# Altium schematic sheet VCO_OUT_channel.SchDoc: Output stage :
size 420 x 297 mm; Author: K.B.; CompanyName: WUT; DrawnBy: K.B.; Organization: WUT ISE; Address1: Warsaw Univeristy of Technology; Address2: Nowowiejska 15/19; DocumentNumber: 5; Revision: -; SheetNumber: 5; SheetTotal: 8; EDA_Number: ARTIQ; Projet: ARTIQ/SINARA; ModifiedBy: -; CreateDate: XX/XX/XXXX; CheckedDate: -; Title2: Attenuator, amplifier and filter; DivGrp: ISE; Designer: K.B.; ModifiedDate: -; ProjectName: ARTIQ/SINARA
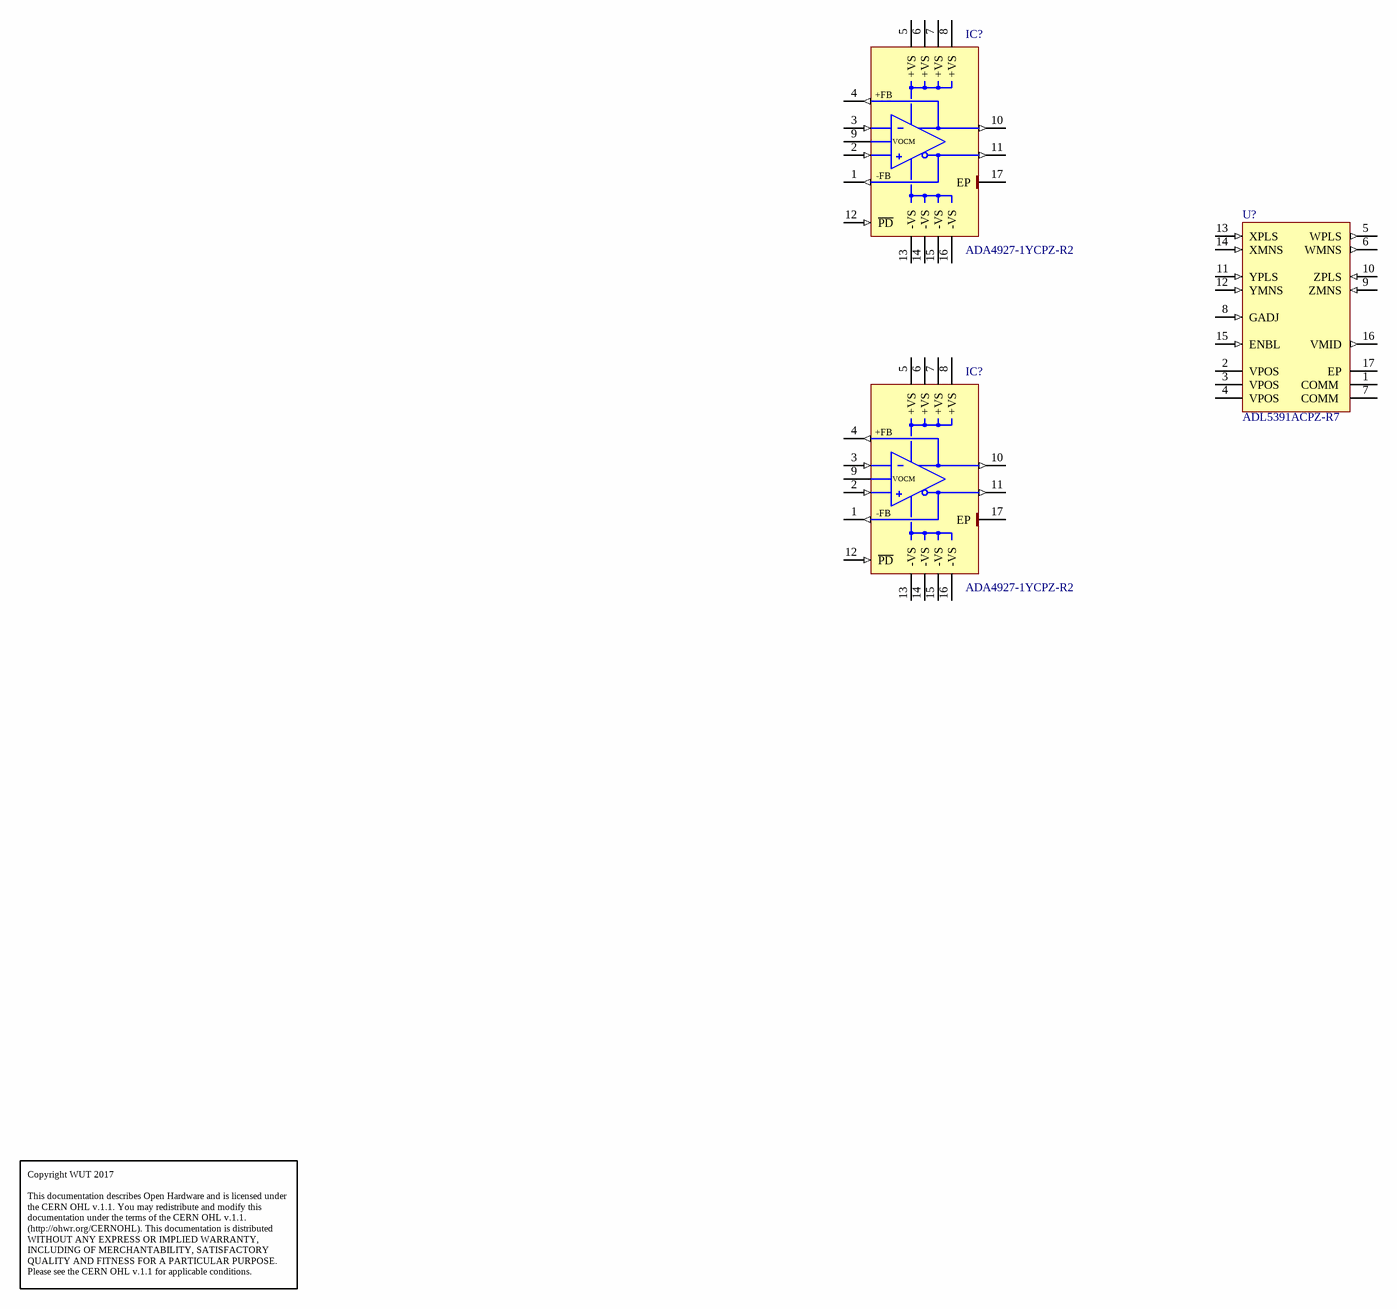
[diagram p0: VCO_OUT_channel.SchDoc]

## Parts
(Parts that share a designator on the sheet are numbered #1, #2 ... from top to bottom, then left to right.)
IC?#1  ADA4927-1YCPZ-R2  [QFN50P300X300X100-17N-S145]
IC?#2  ADA4927-1YCPZ-R2  [QFN50P300X300X100-17N-S145]
U?  ADL5391ACPZ-R7  [ADI-CP-16-3_N]

## Nets

Not connected (* = marked no-connect by the designer): IC?#1 1(-FB) 2(+IN) 3(-IN) 4(+FB) 5(+VS) 6(+VS) 7(+VS) 8(+VS) 9(VOCM) 10(+OUT) 11(-OUT) 12(~{PD}) 13(-VS) 14(-VS) 15(-VS) 16(-VS) 17(EP); IC?#2 1(-FB) 2(+IN) 3(-IN) 4(+FB) 5(+VS) 6(+VS) 7(+VS) 8(+VS) 9(VOCM) 10(+OUT) 11(-OUT) 12(~{PD}) 13(-VS) 14(-VS) 15(-VS) 16(-VS) 17(EP); U? 1(COMM_) 2(VPOS) 3(VPOS) 4(VPOS) 5(WPLS) 6(WMNS) 7(COMM_) 8(GADJ) 9(ZMNS) 10(ZPLS) 11(YPLS) 12(YMNS) 13(XPLS) 14(XMNS) 15(ENBL) 16(VMID) 17(EP)

## Notes on the sheet
- Copyright WUT 2017
  This documentation describes Open Hardware and is licensed under the CERN OHL v.1.1. You may redistribute and modify this documentation under the terms of the CERN OHL v.1.1. (http://ohwr.org/CERNOHL). This documentation is distributed WITHOUT ANY EXPRESS OR IMPLIED WARRANTY, INCLUDING OF MERCHANTABILITY, SATISFACTORY QUALITY AND FITNESS FOR A PARTICULAR PURPOSE. Please see the CERN OHL v.1.1 for applicable conditions.
- Project/Equipment
- Document
- Designer
- Drawn by
- Check.by
- File
- Last Mod.
- Print Date
- Sheet
- Size
- A3
- of
- Rev

## Library data of the parts
IC?#1 IC?#2 = ADA4927-1YCPZ-R2: Ultralow Distortion Current Feedback Differential ADC Driver; Manufacturer: ANALOG DEVICES; PressFit: No; Bonding: No; Part Number: ADA4927-1YCPZ-R2; Component Kind: Standard; Component Type: Standard; Device: ADA4927-1YCPZ-R2; PackageDescription: QFN, 0.50mm pitch, Square; 16 Pin, 3.00mm L X 3.00mm W X 1.00mm H body (w/Thermal Tab 1.45 X 1.45mm), IPC Medium Density; Part Description: Ultralow Distortion Current Feedback Differential ADC Driver; Manufacturer Part Number: ADA4927-1YCP; Pin Count: 17; Case: QFN16; Mounted: Yes; Socket: No; SMD: Yes; Sense: No; ComponentHeight: 1mm; Author: CERN DEM JLC; HelpURL: \\cern.ch\dfs\Applications\Altium\Datasheets\ADA4927-1YCPZ-R2.pdf; CreateDate: 19.04.2010; LatestRevisionDate: 31.03.2022
U? = CMP-0286-00012-1: DC to 2.0 GHz Multiplier, 16-Lead LFCSP, 1dB, 5.5V, 135mA, CP-16-3, Pb-Free, 1500 Reel; Min Pos Supply: 4.5V; P1dB (dBm): 13.2; RF Frequency (MHZ): dc to 2000; IP3 (dBm): 14; PackageDescription: 16-Lead Lead Frame Chip Scale Package [LFCSP_VQ]; ComponentLink3URL: http://www.analog.com/static/imported-files/packages/PKG_PDF/LFCSP(CP)/CP_16_3.pdf; PackageVersion: Jan-2005; ComponentLink2Description: Datasheet; ComponentLink3Description: Package Specification; ComponentLink1URL: www.analog.com; ComponentLink1Description: Manufacturer URL; ComponentLink2URL: http://www.analog.com/static/imported-files/data_sheets/ADL5391.pdf; Voltage Supply (V): 5.5V; DatasheetVersion: Rev. 0; Code_JEDEC: MO-220-VEED-2; PackageReference: CP-16-3